# Altium schematic sheet UART_LOGIC.SchDoc
size A; SheetNumber: 2; SheetTotal: 3
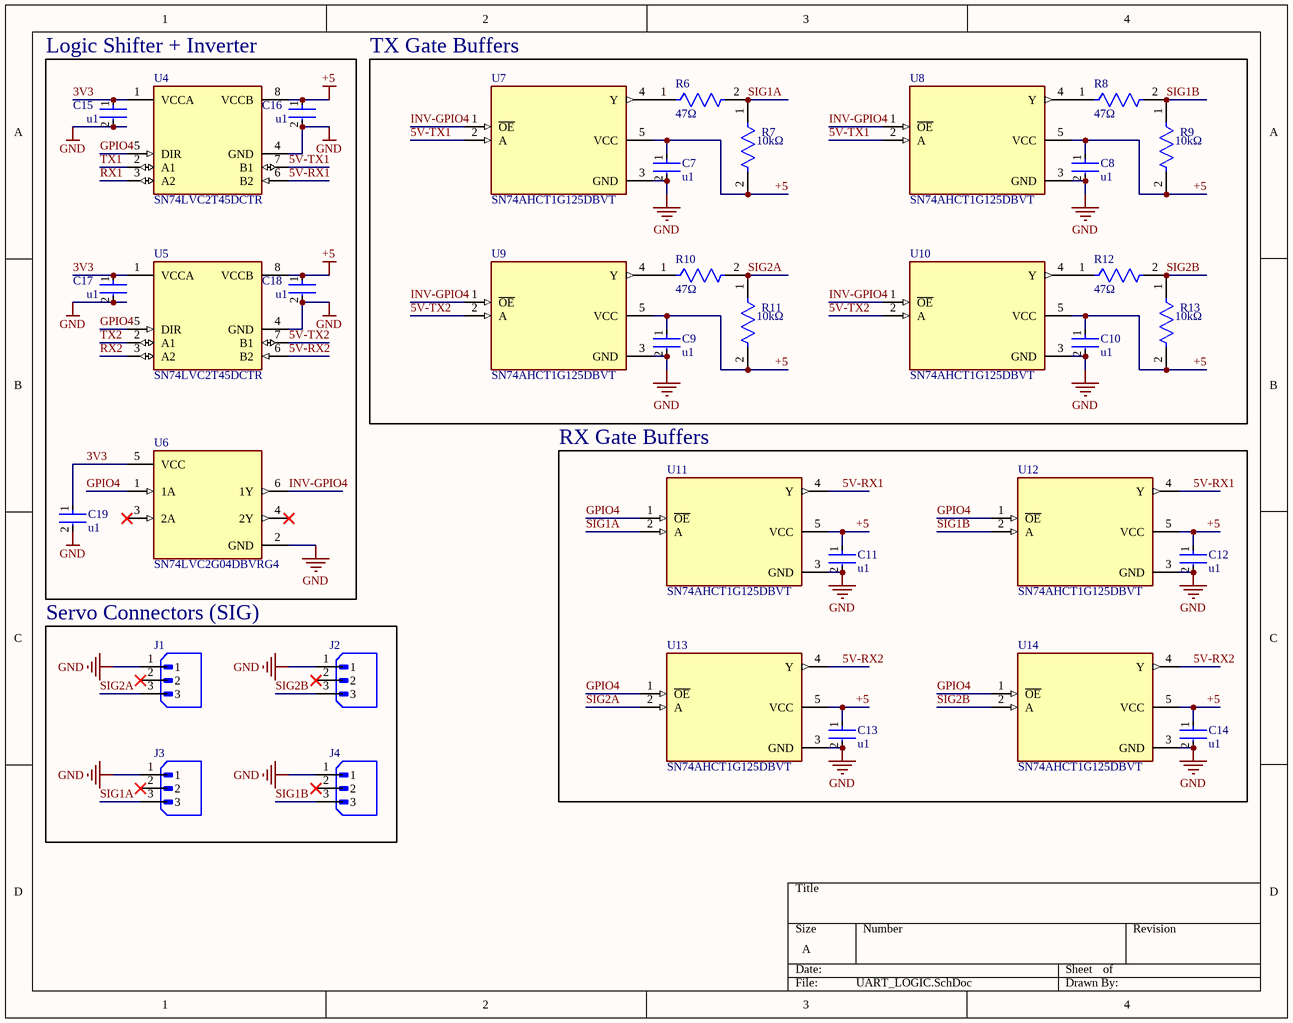
[diagram p0: UART_LOGIC.SchDoc]

## Parts
C7  u1  [FP-CC0805-0_85-MFG]
C8  u1  [FP-CC0805-0_85-MFG]
C9  u1  [FP-CC0805-0_85-MFG]
C10  u1  [FP-CC0805-0_85-MFG]
C11  u1  [FP-CC0805-0_85-MFG]
C12  u1  [FP-CC0805-0_85-MFG]
C13  u1  [FP-CC0805-0_85-MFG]
C14  u1  [FP-CC0805-0_85-MFG]
C15  u1  [FP-CC0805-0_85-MFG]
C16  u1  [FP-CC0805-0_85-MFG]
C17  u1  [FP-CC0805-0_85-MFG]
C18  u1  [FP-CC0805-0_85-MFG]
C19  u1  [FP-CC0805-0_85-MFG]
J1  B3B-XH-A  [JST_B3B-XH-A]  (value not drawn)
J2  B3B-XH-A  [JST_B3B-XH-A]  (value not drawn)
J3  B3B-XH-A  [JST_B3B-XH-A]  (value not drawn)
J4  B3B-XH-A  [JST_B3B-XH-A]  (value not drawn)
R6  47Ω  [FP-RMCF0603-IPC_A]
R7  10kΩ  [FP-RMCF1206-MFG]
R8  47Ω  [FP-RMCF0603-IPC_A]
R9  10kΩ  [FP-RMCF1206-MFG]
R10  47Ω  [FP-RMCF0603-IPC_A]
R11  10kΩ  [FP-RMCF1206-MFG]
R12  47Ω  [FP-RMCF0603-IPC_A]
R13  10kΩ  [FP-RMCF1206-MFG]
U4  SN74LVC2T45DCTR  [FP-DCT0008A-IPC_C]
U5  SN74LVC2T45DCTR  [FP-DCT0008A-IPC_C]
U6  SN74LVC2G04DBVRG4  [FP-DBV0006A-MFG]
U7  SN74AHCT1G125DBVT  [SOT95P280X145-5N]
U8  SN74AHCT1G125DBVT  [SOT95P280X145-5N]
U9  SN74AHCT1G125DBVT  [SOT95P280X145-5N]
U10  SN74AHCT1G125DBVT  [SOT95P280X145-5N]
U11  SN74AHCT1G125DBVT  [SOT95P280X145-5N]
U12  SN74AHCT1G125DBVT  [SOT95P280X145-5N]
U13  SN74AHCT1G125DBVT  [SOT95P280X145-5N]
U14  SN74AHCT1G125DBVT  [SOT95P280X145-5N]

## Blocks framed on the sheet
Logic Shifter + Inverter: C15-C19 U4-U6
TX Gate Buffers: C7-C10 R6-R13 U7-U10
RX Gate Buffers: C11-C14 U11-U14
Servo Connectors (SIG): J1-J4

## Nets
+5: C7.1 C8.1 C9.1 C10.1 C11.1 C12.1 C13.1 C14.1 C16.1 C18.1 R7.2 R9.2 R11.2 R13.2 U4.8(VCCB) U5.8(VCCB) U7.5(VCC) U8.5(VCC) U9.5(VCC) U10.5(VCC) U11.5(VCC) U12.5(VCC) U13.5(VCC) U14.5(VCC)
GND: C7.2 C8.2 C9.2 C10.2 C11.2 C12.2 C13.2 C14.2 C15.2 C16.2 C17.2 C18.2 C19.2 J1.1 J2.1 J3.1 J4.1 U4.4(GND) U5.4(GND) U6.2(GND) U7.3(GND) U8.3(GND) U9.3(GND) U10.3(GND) U11.3(GND) U12.3(GND) U13.3(GND) U14.3(GND)
3V3: C15.1 C17.1 C19.1 U4.1(VCCA) U5.1(VCCA) U6.5(VCC)
5V-RX1: U4.6(B2) U11.4(Y) U12.4(Y)
5V-RX2: U5.6(B2) U13.4(Y) U14.4(Y)
5V-TX1: U4.7(B1) U7.2(A) U8.2(A)
5V-TX2: U5.7(B1) U9.2(A) U10.2(A)
GPIO4: U4.5(DIR) U5.5(DIR) U6.1(1A) U11.1(~{OE}) U12.1(~{OE}) U13.1(~{OE}) U14.1(~{OE})
INV-GPIO4: U6.6(1Y) U7.1(~{OE}) U8.1(~{OE}) U9.1(~{OE}) U10.1(~{OE})
RX1: U4.3(A2)
RX2: U5.3(A2)
SIG1A: J3.3 R6.2 R7.1 U11.2(A)
SIG1B: J4.3 R8.2 R9.1 U12.2(A)
SIG2A: J1.3 R10.2 R11.1 U13.2(A)
SIG2B: J2.3 R12.2 R13.1 U14.2(A)
TX1: U4.2(A1)
TX2: U5.2(A1)
NetR6_1: R6.1 U7.4(Y)
NetR8_1: R8.1 U8.4(Y)
NetR10_1: R10.1 U9.4(Y)
NetR12_1: R12.1 U10.4(Y)

Not connected (* = marked no-connect by the designer): J1 2*; J2 2*; J3 2*; J4 2*; U6 3(2A)* 4(2Y)*

## Library data of the parts
C7-C19 = CMP-2100-03606-3: CC0805KRX7R9BB104 CAP CER 0.1UF 50V X7R 0805; Manufacturer: Yageo; Tolerance: 0.1; Capacitance: 100 nF; Value: 100 nF; Material: Ceramic; Device Class L1: Passive Components; ComponentLink2Description: Datasheet; Package: CC0805-0.85; Manufacturer Part Number: CC0805KRX7R9BB104; Digikey Description: CAP CER 0.1UF 50V X7R 0805; Device Class L3: Ceramic Capacitors; Temperature: -30°C to +85°C; Temperature Characteristic: X7R; Voltage Rating: 50 V; Height: 0.95mm; RoHS: TRUE; Ipc Land Pattern Name: CAPC200125X85; Device Class L2: Capacitors; Category: Cap; Temperature Range Low: -30°C; Temperature Range High: +85°C; Mouser Description: Multilayer Ceramic Capacitors MLCC - SMD/SMT 100nF 50V X7R 10%; Footprint Url: http://www.yageo.com/exep/pages/download/literatures/UPY-C_GEN_24.pdf; Automotive: No; Octopart: https://octopart.com/cc0805krx7r9bb104-yageo-192993; Lead Free: Yes; ComponentLink2URL: http://www.yageo.com/documents/recent/UPY-GPHC_Y5V_6.3V-to-50V_8.pdf
J1-J4 = CMP-002-00071-1: Connector Header Through Hole 3 position 0.098 (2.50mm); MF: JST Sales; Case/Package: None; Pins: 3; SnapEDA_Link: https://www.snapeda.com/parts/B3B-XH-A/JST+Sales+America+Inc./view-part/?ref=snap; MP: B3B-XH-A; Component Type: Standard; Check_prices: https://www.snapeda.com/parts/B3B-XH-A/JST+Sales+America+Inc./view-part/?ref=eda; Source: B3B-XH-A.SchLib; Value: *; Design Item ID: B3B-XH-A
R6 R8 R10 R12 = CMP-26527-000678-1: 47Ω ±1% 0.1W 0603 Thick Film Chip Resistor AEC-Q200 compliant RMCF0603FG47R0; Power Rating: 100mW; Resistance: 47R; Case/Package: 0603; RoHS Compliant: Yes
R7 R9 R11 R13 = CMP-26527-002036-1: 10kΩ ±1% 0.25W 1206 Thick Film Chip Resistor AEC-Q200 compliant RMCF1206FG10K0; Max Power Dissipation: 250mW; Resistance: 10kR; Temperature Coefficient: 100ppm/°C; Construction: Rectangular; Contact Plating: Tin; Max Operating Temperature: 155°C; Features: Automotive AEC-Q200; Radiation Hardening: No; Military Standard: Not; RoHS Compliant: Yes; Length: 0.126inch; Number of Terminations: 2; Mount: Surface Mount; Case Code (Imperial): 1206; Case Code (Metric): 3216; Series: RMCF; Width: 0.063inch; Min Operating Temperature: -55°C; Height: 0.028inch; Resistor Type: Thick Film; Packaging: Tape and Reel; Tolerance: 1%; Depth: 1.6mm; Case/Package: 1206
U4 U5 = CMP-0000-1: 2-Bit Dual Supply Transceiver with Configurable Voltage-Level Shifting and 3-State Outputs 8-SSOP -40 to 85; Manufacturer Lifecycle Status: ACTIVE; High Level Output Current: -32mA; Low Level Output Current: 32mA; Min Supply Voltage: 1.65V; Max Junction Temperature (Tj): 150°C; Polarity: Non-Inverting; Max Supply Voltage: 5.5V; Turn-On Delay Time: 17.7ns; Number of Channels: 2; Quiescent Current: 3µA; Number of Circuits: 1; Direction: Bidirectional; Data Rate: 420Mbps; Logic Function: Transceiver, Translator; Output Current: 50mA; Propagation Delay: 45.2ns; Packaging: Cut Tape; Contact Plating: Gold; Min Operating Temperature: -40°C; Ambient Temperature Range High: 85°C; Max Operating Temperature: 85°C; Height: 1.3mm; Width: 2.8mm; RoHS: Compliant; REACH SVHC: No; Length: 2.95mm; Weight: 23.388357mg; Lifecycle Status: Production; Schedule B: 8542390000, 8542390000; Pins: 8; Lead Free: Lead Free; Number of Bits: 2; Radiation Hardening: No; Number of Inputs: 1; Number of Elements: 1; Number of Outputs: 1; Thickness: 1.29mm; Case/Package: SSOP
U6 = CMP-04903-000086-1: IC INVERTER 2CH 2-INP SOT23-6; Quiescent Current: 10uA; Number of Elements: 2; Propagation Delay: 3.7ns; Min Supply Voltage: 1.65V; High Level Output Current: -32mA; Max Supply Voltage: 5.5V; Low Level Output Current: 32mA; Operating Supply Voltage: 5V; Turn-On Delay Time: 8ns; Mount: Surface Mount; Min Operating Temperature: -40°C; Logic Function: Inverter; Lead Free: Lead Free; Number of Bits: 2; Number of Pins: 6; Radiation Hardening: No; Max Operating Temperature: 125°C; Number of Circuits: 2; Weight: 0.000557oz; Number of Inputs: 2; RoHS Compliant: Yes; Technology: CMOS; Packaging: Tape and Reel; Number of Gates: 2; Case/Package: SOT-23-6; Package Quantity: 3000; Series: 74LVC
U7-U14 = CMP-009-000000-3: Single 4.5-V to 5.5-V buffer with TTL-compatible CMOS inputs and 3-state outputs; MF: Texas Instruments; Pin Count: 5; Design Item ID: SN74AHCT1G125DBVT; Value: *; Source: SN74AHCT1G125DBVT.SchLib; Check_prices: https://www.snapeda.com/parts/SN74AHCT1G125DBVT/Texas+Instruments/view-part/?ref=eda; Package: SOT-23-5 Texas Instruments; MP: SN74AHCT1G125DBVT; Component Type: Standard; SnapEDA_Link: https://www.snapeda.com/parts/SN74AHCT1G125DBVT/Texas+Instruments/view-part/?ref=snap